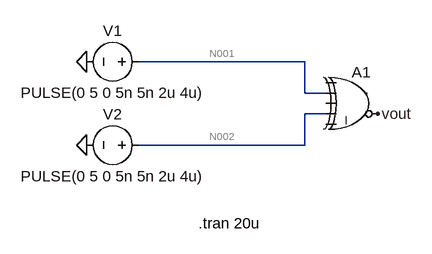
[diagram p0: schematic Draft1.asc]
Draft1.asc, the LTspice schematic file:
Version 4
SHEET 1 880 680
WIRE 176 176 -80 176
WIRE 176 224 176 176
WIRE 208 224 176 224
WIRE 208 256 176 256
WIRE 176 304 176 256
WIRE 176 304 -80 304
FLAG -160 176 0
FLAG -160 304 0
FLAG 288 256 vout
SYMBOL voltage -64 176 R90
WINDOW 0 -32 56 VBottom 2
WINDOW 3 32 56 VTop 2
WINDOW 123 0 0 Left 0
WINDOW 39 0 0 Left 0
SYMATTR InstName V1
SYMATTR Value PULSE(0 5 0 5n 5n 2u 4u)
SYMBOL voltage -64 304 R90
WINDOW 0 -32 56 VBottom 2
WINDOW 3 32 56 VTop 2
WINDOW 123 0 0 Left 0
WINDOW 39 0 0 Left 0
SYMATTR InstName V2
SYMATTR Value PULSE(0 5 0 5n 5n 2u 4u)
SYMBOL Digital\\xor 256 176 R0
SYMATTR InstName A1
TEXT 12 424 Left 2 !.tran 20u

The netlist it stands for:
* Draft1.asc
V1 N001 0 PULSE(0 5 0 5n 5n 2u 4u)
V2 N002 0 PULSE(0 5 0 5n 5n 2u 4u)
A1 0 N001 0 N002 0 vout 0 0 XOR
.tran 20u
.backanno
.end

* Results of the author's LTspice run, read from the files saved beside the schematic
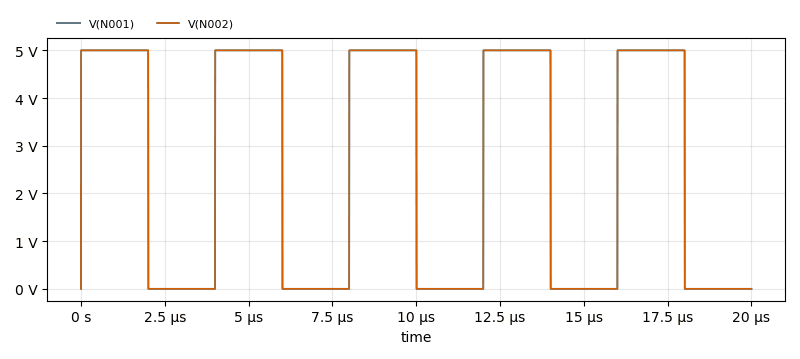
[diagram p1: Transient Analysis of Draft1.asc, plotted from the saved traces]
* Transient Analysis, 1 run:
*   V(N001): min 0 V, max 5 V, average 2.506 V, rms 3.54 V, last 0 V
*   V(N002): min 0 V, max 5 V, average 2.506 V, rms 3.54 V, last 0 V